# EAGLE design Adafruit PN532_Breakout_v1.6 (EAGLE 9.6.2)
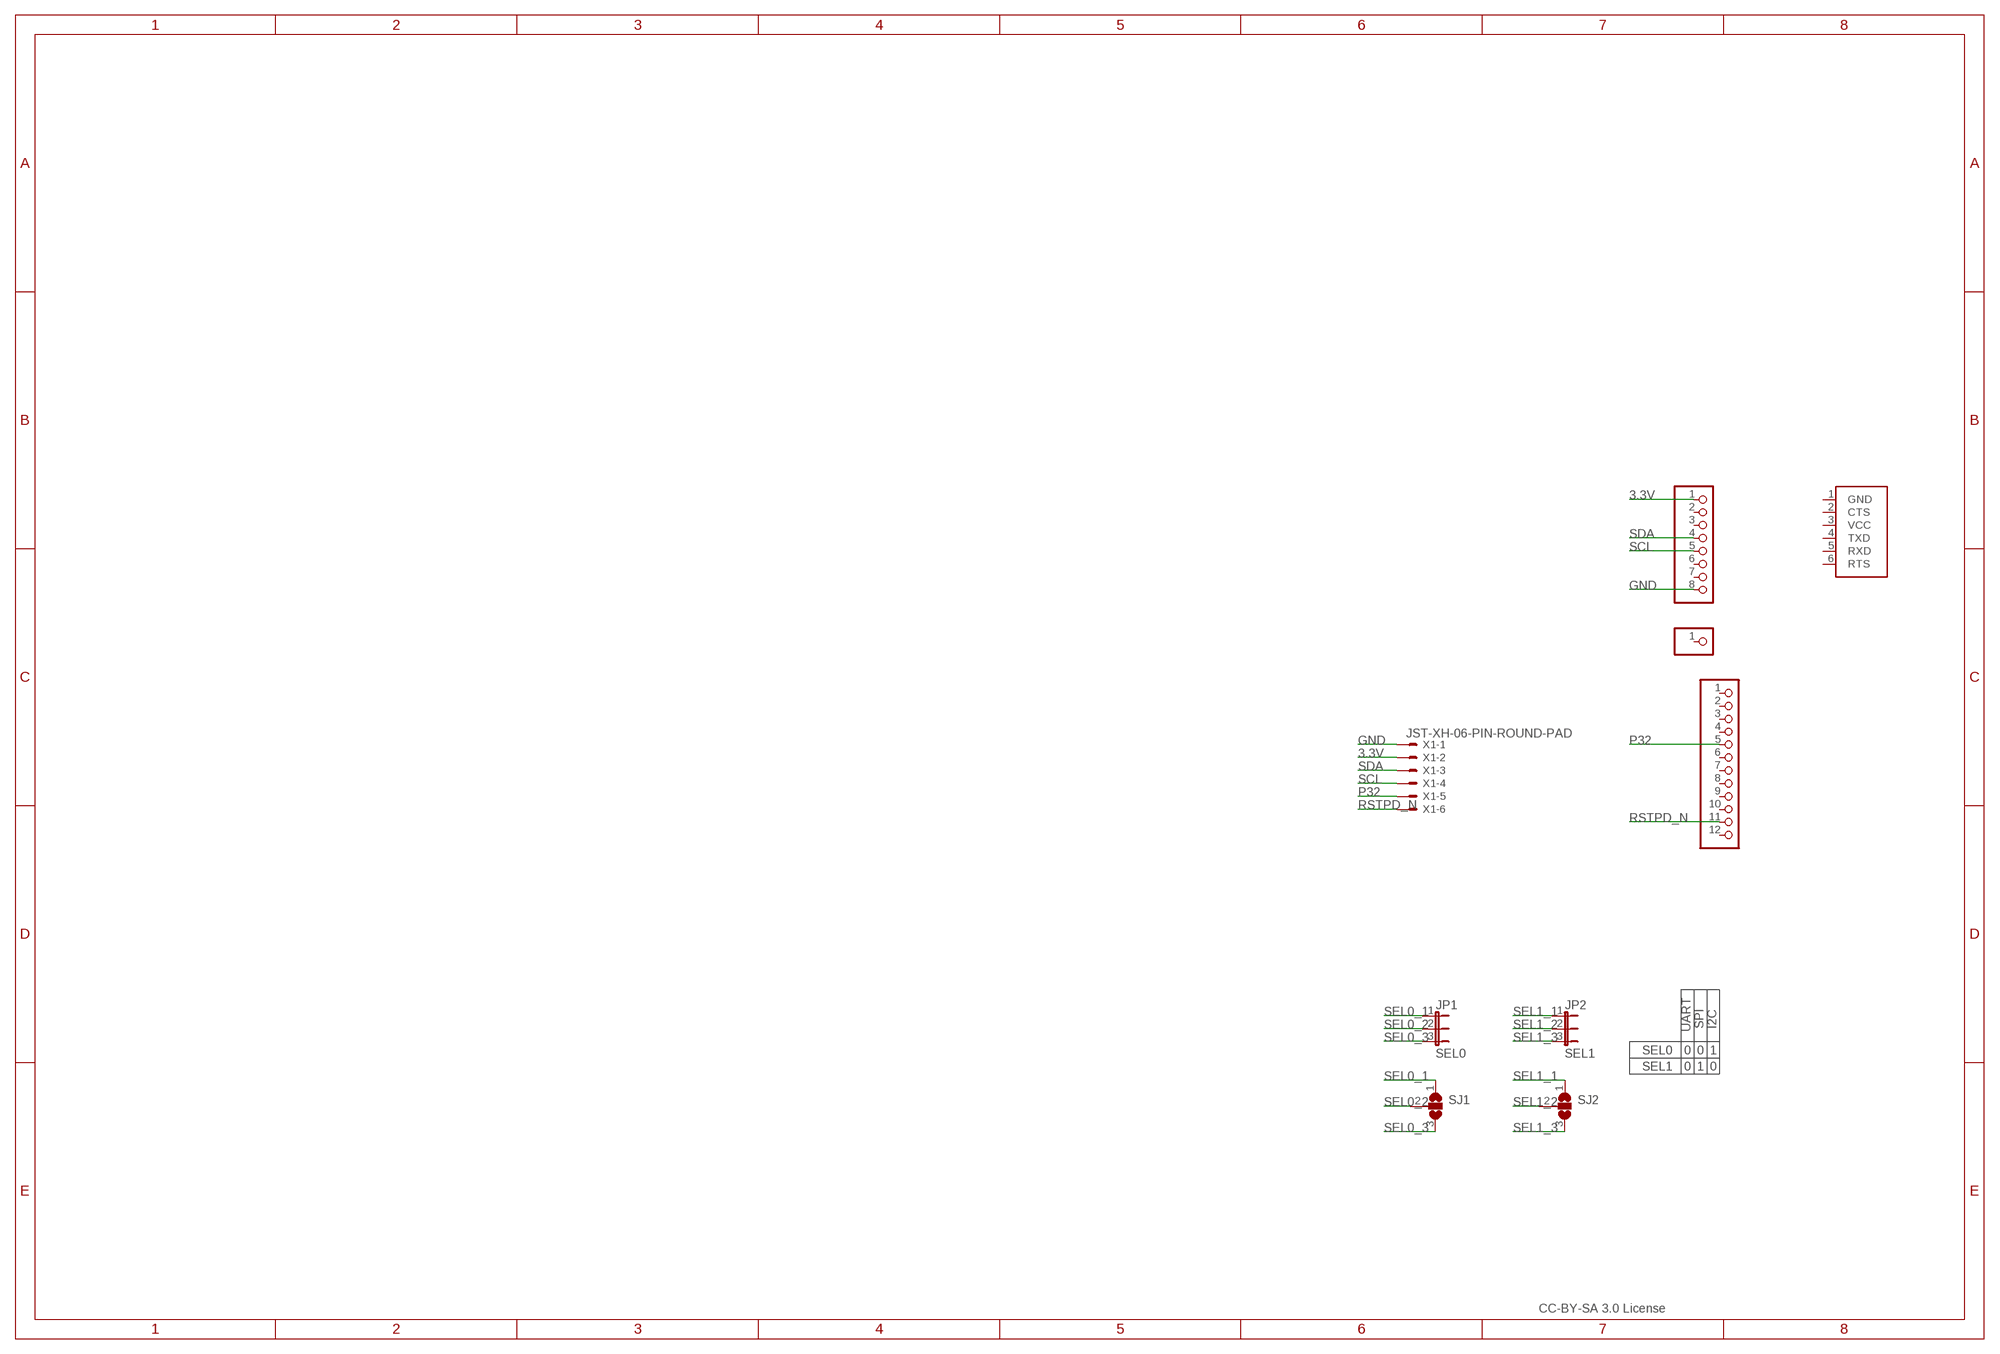
[diagram p0: schematic, sheet 1]

## Parts
CN1  FTDI  FTDIUSBCABLE  [1X06_ROUND]
JP1  SEL0  JUMPER3  [JUMPER3]
JP2  SEL1  JUMPER3  [JUMPER3]
JP3  HEADER-1X12  [1X12_ROUND]
JP4  HEADER-1X8ROUND  [1X08_ROUND]
JP5  HEADER-1X1ROUND  [1X01_ROUND]
SJ1  SJ2W  [SJ_2]
SJ2  SJ2W  [SJ_2]
X1  JST-XH-06-PIN-ROUND-PAD  [JST-XH-06-PACKAGE-ROUND-PAD]

## Nets
3.3V: JP4.1 X1.2
GND: JP4.8 X1.1
P32: JP3.5 X1.5
RSTPD_N: JP3.11 X1.6
SCL: JP4.5 X1.4
SDA: JP4.4 X1.3
SEL0_1: JP1.1 SJ1.1
SEL0_2: JP1.2 SJ1.2
SEL0_3: JP1.3 SJ1.3
SEL1_1: JP2.1 SJ2.1
SEL1_2: JP2.2 SJ2.2
SEL1_3: JP2.3 SJ2.3
Unconnected: CN1.1(GND) CN1.2(CTS) CN1.3(VCC) CN1.4(TXD) CN1.5(RXD) CN1.6(RTS) JP3.1 JP3.2 JP3.3 JP3.4 JP3.6 JP3.7 JP3.8 JP3.9 JP3.10 JP3.12 JP4.2 JP4.3 JP4.6 JP4.7 JP5.1

## Notes on the sheet
- UART | SPI | I2C
- SEL0 | 0 | 0 | 1
- SEL1 | 0 | 1 | 0
- CC-BY-SA 3.0 License

## Library data of the parts
CN1 = microbuilder:FTDIUSBCABLE: FTDI TTL-232R USB Cable Connector for FTDI's USB->RS232 Cable
JP1 JP2 = microbuilder:JUMPER3: JUMPER - 3 Pins
JP3 = microbuilder:HEADER-1X12
JP4 = microbuilder:HEADER-1X8: PIN HEADER
JP5 = microbuilder:HEADER-1X1: PIN HEADER
SJ1 SJ2 = jumper:SJ2W: SMD solder JUMPER
X1 = Rembrandt Electronics - JST XH Connectors v1-0:JST-XH-06-PIN: JST XH Connector 2 Pin Wire to board connector. Pitch: 2,54 mm, (0.100") Number of pins: 6 Created by Rembrandt Electronics www.rembrandtelectronics.com

## Board
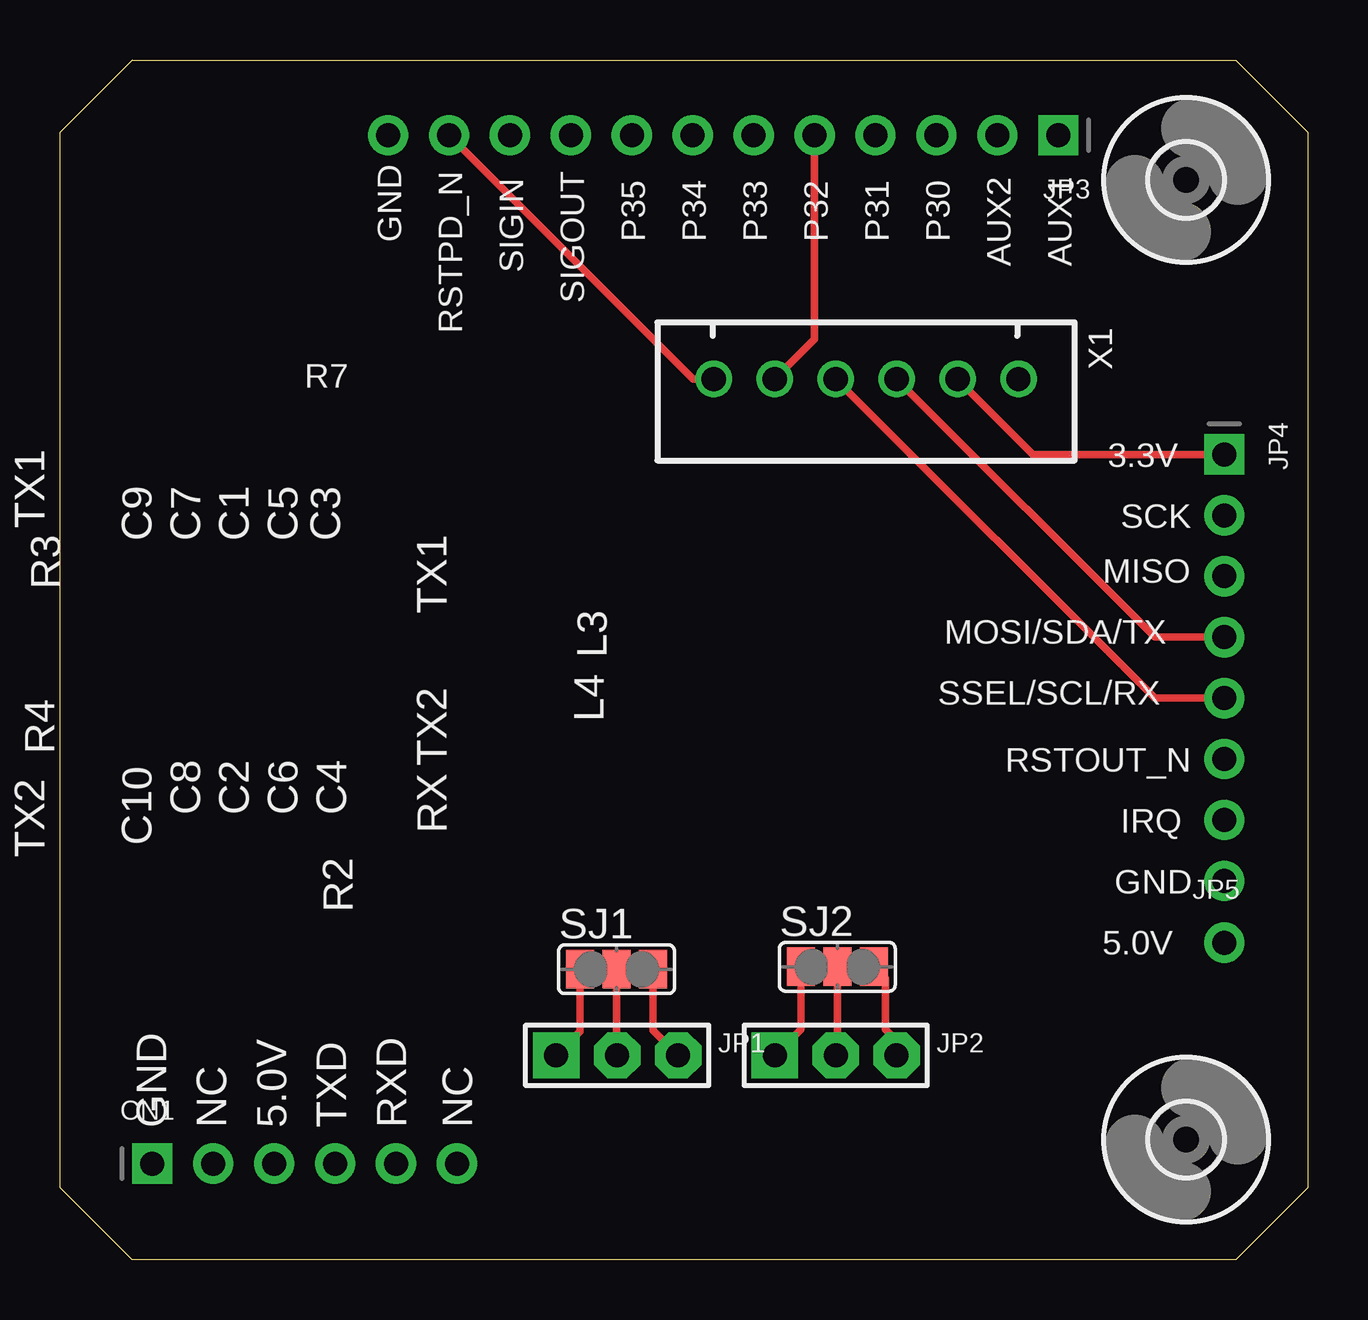
[diagram p1: board, top side]
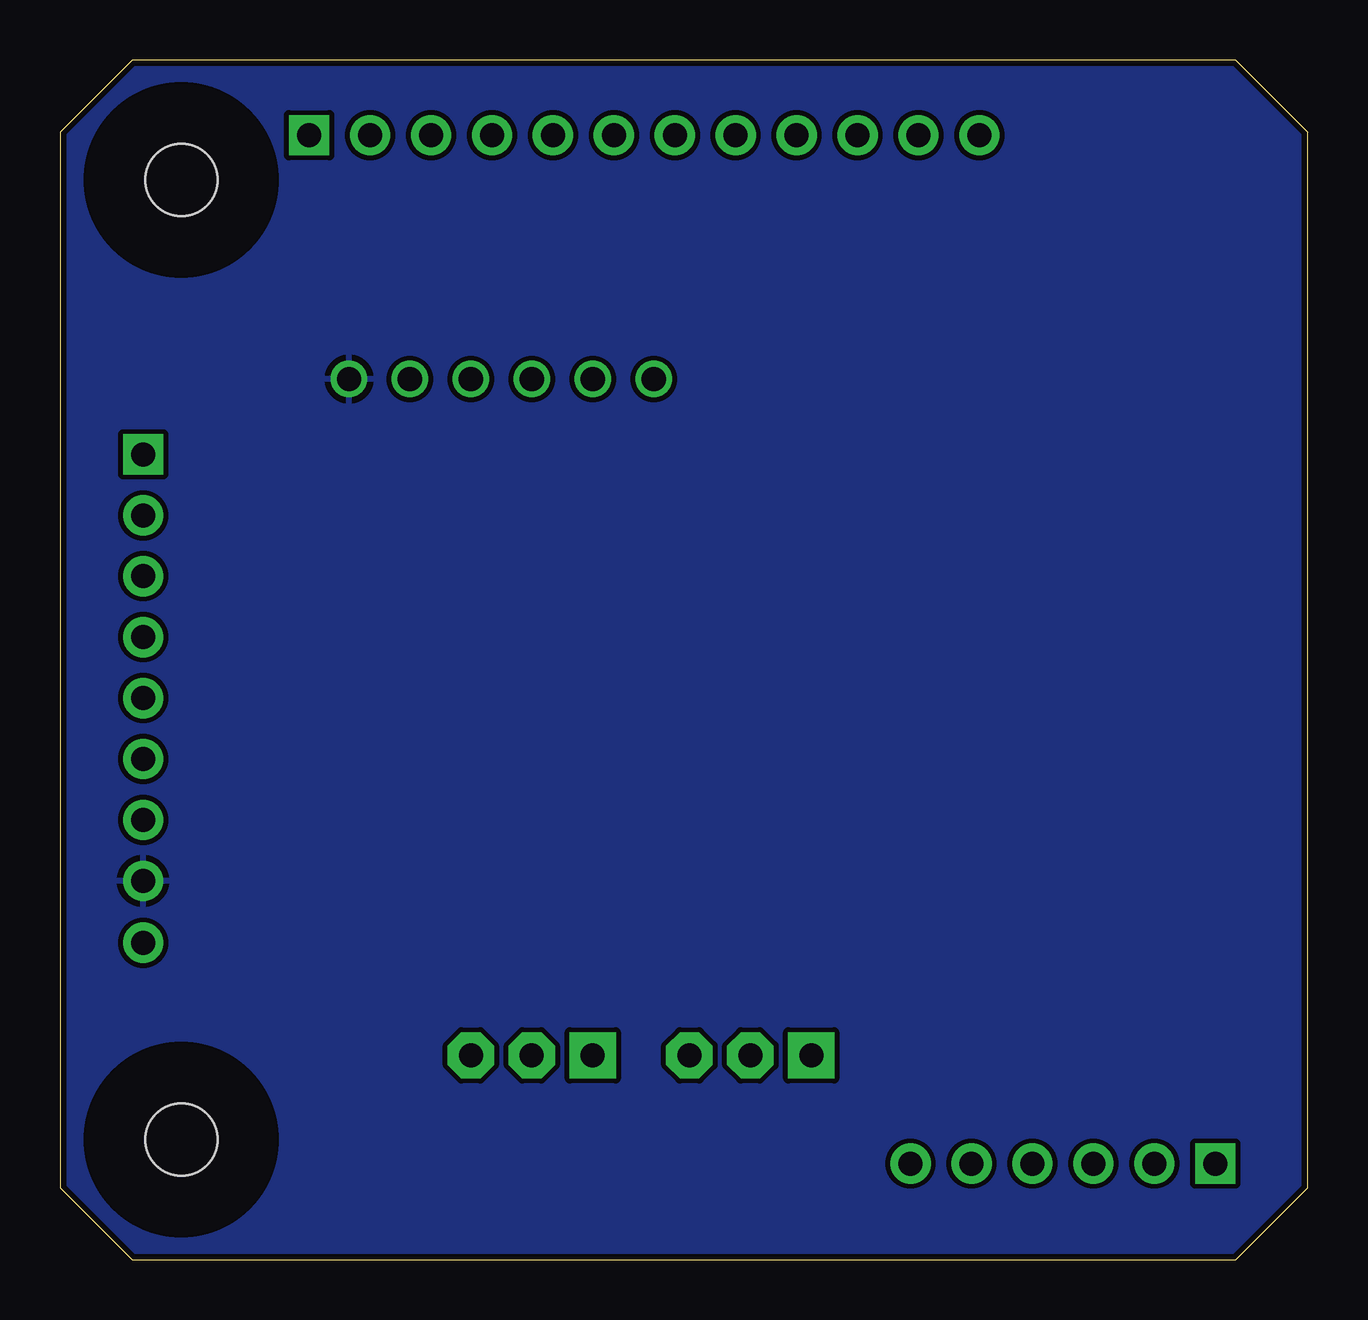
[diagram p2: board, bottom side, seen from below]

Size 52 x 50 mm. Coordinates in mm from the lower left corner, seen from the top.
Outline: 49,0 3,0 0,3 0,47 3,50 49,50 52,47 52,3 49,0
Copper layers (1*16): Top 0.035mm / dielectric 1.5mm / Bottom 0.035mm
Design rules "adafruit": minimum track width 8mil, minimum drill 15.5mil, track to track 8mil, track to pad 8mil, pad to pad 8mil, via to via 8mil, smd to smd 8mil, copper to edge 10mil, drill to drill 8mil, minimum pad ring 10mil, minimum via ring 8mil, stop-mask expansion 2mil, vias tented up to drill 20mil, thermal gap 10mil
tRestrict: area 13.4,47.8 to 14,47.9; area 13.4,45.8 to 14,46; area 12.6,46.5 to 12.7,47.1; area 48.3,16.6 to 48.9,16.8; area 48.3,14.7 to 48.9,14.9; area 47.5,15.5 to 47.6,16.1; area 34.6,7.2 to 35.2,7.4; area 34.6,9.7 to 35.2,9.8; area 33.5,8.3 to 33.7,8.9; area 24.5,8.3 to 24.7,8.9; area 25.4,9.7 to 26.1,9.8; area 25.4,7.2 to 26.1,7.4; 5 more areas
bRestrict: area -58.9,26.9 to -53.8,28.2; area -58.9,22.1 to -53.8,23.4; area -53.3,6.3 to -4,44.2

### Footprints (pad centres in the part's own frame; a part is rotated, then mirrored left to right if it is on the bottom)
1X06_ROUND = drill 1 pad 1.676 square: 1 -6.35,0 | drill 1 pad 1.676: 2 -3.81,0; 3 -1.27,0; 4 1.27,0; 5 3.81,0; 6 6.35,0
JUMPER3 = drill 1 pad 1.93 square: 1 -2.54,0 | drill 1 pad 1.93 octagon: 2 0,0; 3 2.54,0
1X12_ROUND = drill 1 pad 1.676 square: 1 -13.97,0 | drill 1 pad 1.676: 2 -11.43,0; 3 -8.89,0; 4 -6.35,0; 5 -3.81,0; 6 -1.27,0; 7 1.27,0; 8 3.81,0; 9 6.35,0; 10 8.89,0; 11 11.43,0; 12 13.97,0
1X08_ROUND = drill 1 pad 1.676 square: 1 -8.89,0 | drill 1 pad 1.676: 2 -6.35,0; 3 -3.81,0; 4 -1.27,0; 5 1.27,0; 6 3.81,0; 7 6.35,0; 8 8.89,0
1X01_ROUND = drill 1 pad 1.676: 1 0,0
SJ_2 = smd 1.168 x 1.6: 1 -1.524,0; 2 0,0; 3 1.524,0
MOUNTINGHOLE_3.0 = hole 3: 0,0
JST-XH-06-PACKAGE-ROUND-PAD = drill 1.016: 1 -6.35,0; 2 -3.81,0; 3 -1.27,0; 4 1.27,0; 5 3.81,0; 6 6.35,0

### Placement (x,y rotation side)
CN1  10.19,4 0 top
JP1  23.22,8.51 0 top
JP2  32.33,8.51 0 top
JP3  27.64,46.87 180 top
JP4  48.53,24.67 270 top
JP5  48.53,13.21 0 top
SJ1  23.2,12.1 0 top
SJ2  32.4,12.2 0 top
U$37  [MOUNTINGHOLE_3.0]  46.94,5 0 top
U$38  [MOUNTINGHOLE_3.0]  46.94,45 0 top
X1  33.6,36.7 180 top

### Tracks (layer width: path | path; a pad name or v marks a point on that pad's centre or on a via)
3.3V
  Top 0.203: JP4.1 48.53,33.67
  Top 0.305: JP4.1 40.55,33.56 X1.2
GND
  pour Bottom: 3,50 0,47 0,3 3,0 49,0 52,3 52,47 49,50
P32
  Top 0.305: JP3.5 31.45,38.36 X1.5
RSTPD_N
  Top 0.305: X1.6 26.38,36.7 JP3.11
SCL
  Top 0.305: JP4.5 45.63,23.4 X1.4
SDA
  Top 0.305: JP4.4 45.63,25.94 X1.3
SEL0_1
  Top 0.305: SJ1.1 21.68,9.5 JP1.1
SEL0_2
  Top 0.305: SJ1.2 23.2,8.53 JP1.2
SEL0_3
  Top 0.305: SJ1.3 24.72,9.55 JP1.3
SEL1_1
  Top 0.305: SJ2.1 30.88,9.59 JP2.1
SEL1_2
  Top 0.305: SJ2.2 32.4,8.58 JP2.2
SEL1_3
  Top 0.305: JP2.3 34.87,9.12 34.41,9.59 34.41,11.72 SJ2.3

### Text on the board
tPlace: GND | P35 | P34 | P33 | P32 | P31 | P30 | SIGIN | AUX2 | AUX1 | SIGOUT | RSTPD_N | 3.3V | SCK | MISO | MOSI/SDA/TX | SSEL/SCL/RX | RSTOUT_N | IRQ | GND | 5.0V | GND | NC | 5.0V | TXD | RXD | NC
tNames: R7 | TX1 | C9 | C7 | C1 | C5 | C3 | R3 | TX1 | L3 | L4 | R4 | TX2 | C8 | C2 | C6 | C4 | RX | TX2 | C10 | R2